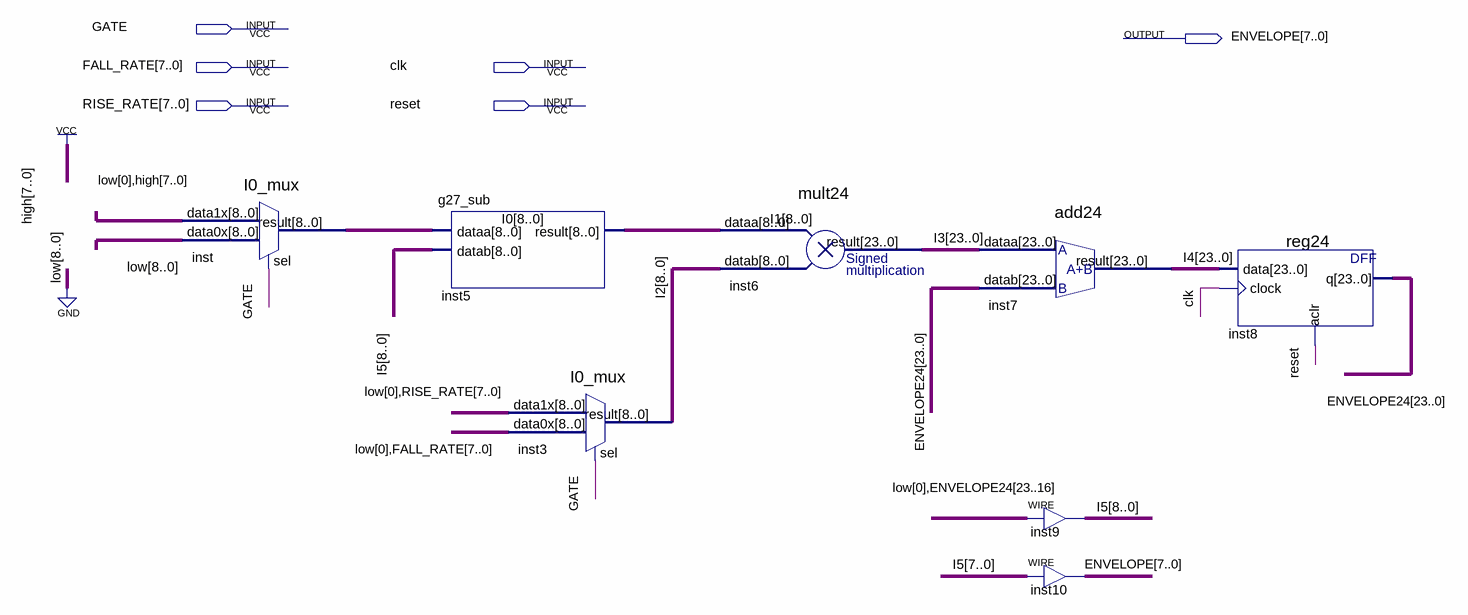
[diagram p0: schematic sheet]
// Quartus schematic g27_envelope_schematic.bdf as structural Verilog: 8 symbols, 6 pins
module g27_envelope_schematic (
  input  GATE,
  input  [7:0] FALL_RATE,
  input  clk,
  input  [7:0] RISE_RATE,
  input  reset,
  output [7:0] ENVELOPE
);

  wire [8:0] I0, I1, I2, I5;
  wire [23:0] ENVELOPE24, I3, I4;

  I0_mux inst (.data1x(9'b011111111), .data0x({9{1'b0}}), .sel(GATE), .result(I0));
  g27_sub inst5 (.dataa(I0), .datab(I5), .result(I1));
  I0_mux inst3 (.data1x({1'b0, RISE_RATE}), .data0x({1'b0, FALL_RATE}), .sel(GATE), .result(I2));
  mult24 inst6 (.dataa(I1), .datab(I2), .result(I3));
  add24 inst7 (.dataa(I3), .datab(ENVELOPE24), .result(I4));
  assign I5 = {1'b0, ENVELOPE24[23:16]};  // WIRE inst9
  assign ENVELOPE = I5[7:0];  // WIRE inst10
  reg24 inst8 (.data(I4), .clock(clk), .aclr(reset), .q(ENVELOPE24));
endmodule
